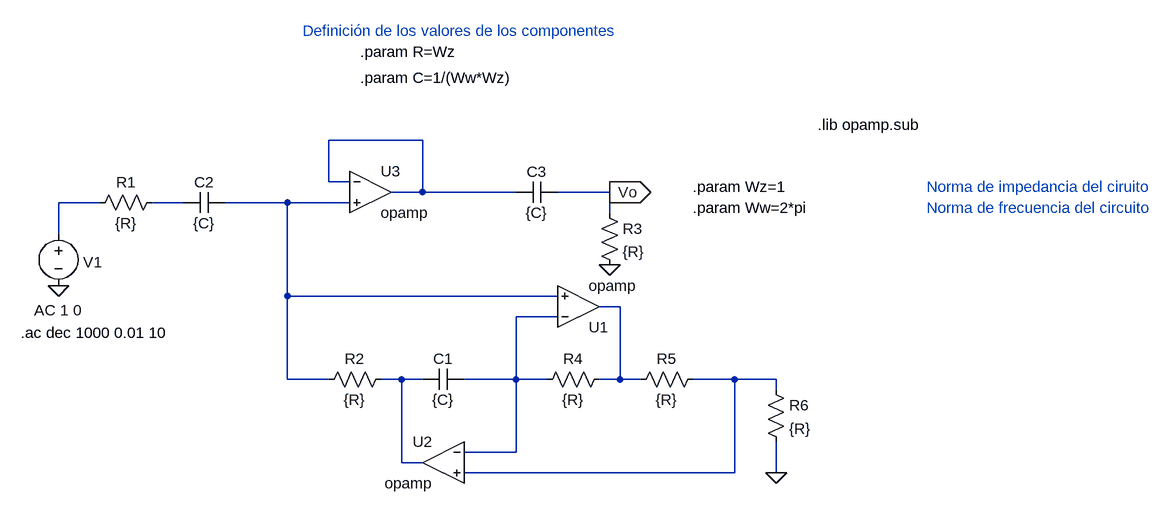
[diagram p0: schematic Draft1.asc]
Draft1.asc, the LTspice schematic file:
Version 4
SHEET 1 1432 680
WIRE -240 -224 -384 -224
WIRE -384 -160 -384 -224
WIRE -352 -160 -384 -160
WIRE -240 -144 -240 -224
WIRE -240 -144 -288 -144
WIRE -96 -144 -240 -144
WIRE 48 -144 -32 -144
WIRE -736 -128 -800 -128
WIRE -608 -128 -656 -128
WIRE -448 -128 -544 -128
WIRE -352 -128 -448 -128
WIRE 48 -112 48 -144
WIRE -800 -80 -800 -128
WIRE -448 16 -448 -128
WIRE -32 16 -448 16
WIRE 64 32 32 32
WIRE -32 48 -96 48
WIRE -448 144 -448 16
WIRE -384 144 -448 144
WIRE -272 144 -304 144
WIRE -240 144 -272 144
WIRE -96 144 -96 48
WIRE -96 144 -176 144
WIRE -48 144 -96 144
WIRE 64 144 64 32
WIRE 64 144 32 144
WIRE 96 144 64 144
WIRE 240 144 176 144
WIRE 304 144 240 144
WIRE 304 160 304 144
WIRE -96 256 -96 144
WIRE -96 256 -176 256
WIRE -272 272 -272 144
WIRE -240 272 -272 272
WIRE 240 288 240 144
WIRE 240 288 -176 288
WIRE 304 288 304 240
FLAG 304 288 0
FLAG 48 -32 0
FLAG -800 0 0
FLAG 48 -144 Vo
IOPIN 48 -144 Out
SYMBOL res -640 -144 R90
WINDOW 0 0 56 VBottom 2
WINDOW 3 32 56 VTop 2
SYMATTR InstName R1
SYMATTR Value {R}
SYMBOL res -288 128 R90
WINDOW 0 0 56 VBottom 2
WINDOW 3 32 56 VTop 2
SYMATTR InstName R2
SYMATTR Value {R}
SYMBOL cap -176 128 R90
WINDOW 0 0 32 VBottom 2
WINDOW 3 32 32 VTop 2
SYMATTR InstName C1
SYMATTR Value {C}
SYMBOL cap -544 -144 R90
WINDOW 0 0 32 VBottom 2
WINDOW 3 32 32 VTop 2
SYMATTR InstName C2
SYMATTR Value {C}
SYMBOL cap -32 -160 R90
WINDOW 0 0 32 VBottom 2
WINDOW 3 32 32 VTop 2
SYMATTR InstName C3
SYMATTR Value {C}
SYMBOL res 32 -128 R0
SYMATTR InstName R3
SYMATTR Value {R}
SYMBOL res 48 128 R90
WINDOW 0 0 56 VBottom 2
WINDOW 3 32 56 VTop 2
SYMATTR InstName R4
SYMATTR Value {R}
SYMBOL res 192 128 R90
WINDOW 0 0 56 VBottom 2
WINDOW 3 32 56 VTop 2
SYMATTR InstName R5
SYMATTR Value {R}
SYMBOL res 288 144 R0
SYMATTR InstName R6
SYMATTR Value {R}
SYMBOL Opamps\\opamp 0 96 M180
SYMATTR InstName U1
SYMBOL Opamps\\opamp -208 208 M0
SYMATTR InstName U2
SYMBOL Opamps\\opamp -320 -208 R0
SYMATTR InstName U3
SYMBOL voltage -800 -96 R0
WINDOW 0 38 60 Left 2
WINDOW 123 -37 134 Left 2
WINDOW 39 0 0 Left 2
SYMATTR InstName V1
SYMATTR Value ""
SYMATTR Value2 AC 1 0
TEXT 368 -248 Left 2 !.lib opamp.sub
TEXT -858 72 Left 2 !.ac dec 1000 0.01 10
TEXT -336 -360 Left 2 !.param R=Wz
TEXT -336 -320 Left 2 !.param C=1/(Ww*Wz)
TEXT -424 -392 Left 2 ;Definición de los valores de los componentes
TEXT 176 -152 Left 2 !.param Wz=1
TEXT 176 -120 Left 2 !.param Ww=2*pi
TEXT 536 -120 Left 2 ;Norma de frecuencia del circuito
TEXT 536 -152 Left 2 ;Norma de impedancia del ciruito

The netlist it stands for:
* Draft1.asc
R1 N003 N002 {R}
R2 N007 N004 {R}
C1 N006 N007 {C}
C2 N004 N003 {C}
C3 Vo N001 {C}
R3 Vo 0 {R}
R4 N005 N006 {R}
R5 N008 N005 {R}
R6 N008 0 {R}
XU1 N006 N004 N005 opamp Aol=100K GBW=10Meg  ; pins invin noninvin out
XU2 N006 N008 N007 opamp Aol=100K GBW=10Meg  ; pins invin noninvin out
XU3 N001 N004 N001 opamp Aol=100K GBW=10Meg  ; pins invin noninvin out
V1 N002 0 AC 1 0
.lib opamp.sub
.ac dec 1000 0.01 10
.param R=Wz
.param C=1/(Ww*Wz)
* Definición de los valores de los componentes
.param Wz=1
.param Ww=2*pi
* Norma de frecuencia del circuito
* Norma de impedancia del ciruito
.backanno
.end